# EAGLE schematic ARCAdaptor (EAGLE 6.4)
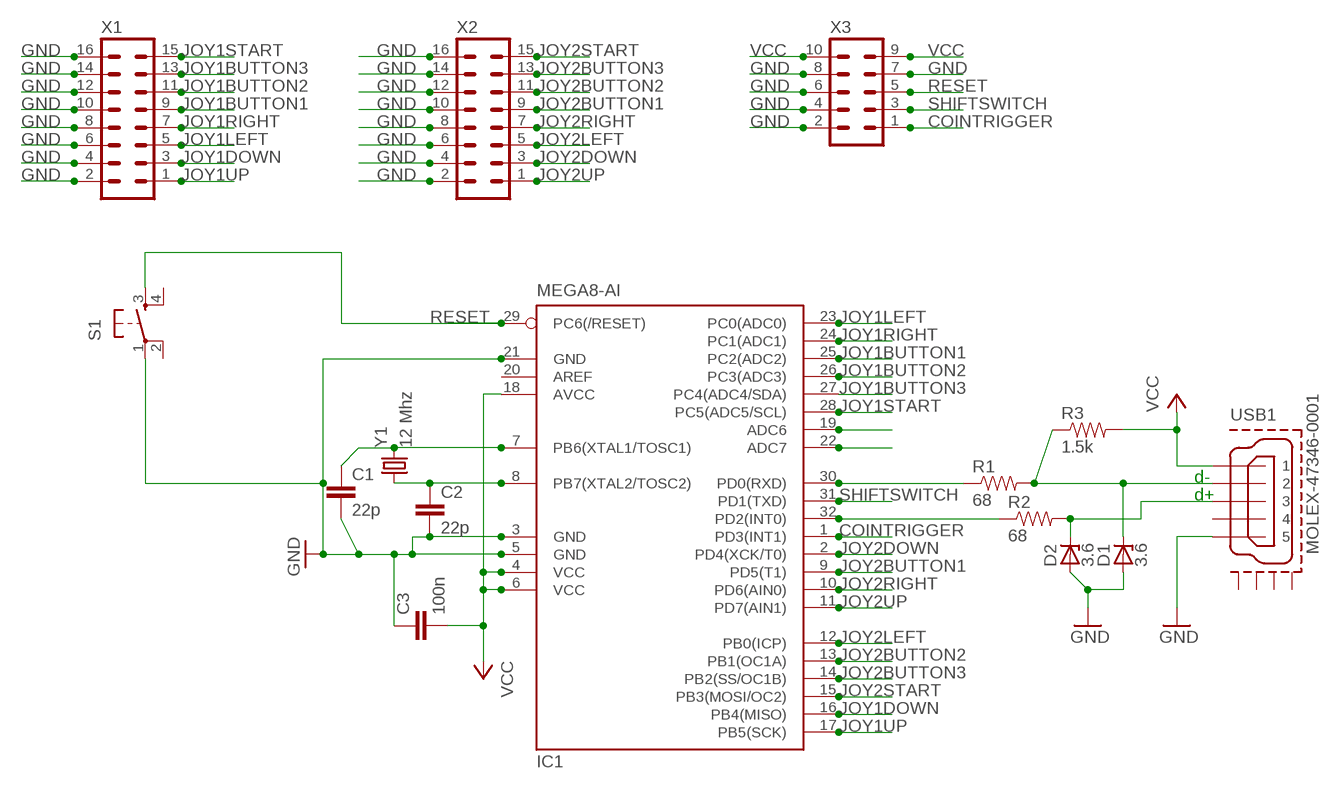
[diagram p0: schematic, sheet 1]

## Parts
C1  22p  CAP0805  [0805]
C2  22p  CAP0805  [0805]
C3  100n  CAP0805  [0805]
D1  3.6  ZENER-DIODESOT23  [SOT23]
D2  3.6  ZENER-DIODESOT23  [SOT23]
IC1  MEGA8-AI  [TQFP32-08]
R1  68  RESISTOR0805-RES  [0805]
R2  68  RESISTOR0805-RES  [0805]
R3  1.5k  RESISTOR0805-RES  [0805]
S1  TAC_SWITCHSMD  [TACTILE_SWITCH_SMD]
USB1  MOLEX-47346-0001  [MOLEX-47364-0001]
X1  MA08-2  [MA08-2]
X2  MA08-2  [MA08-2]
X3  MA05-2  [MA05-2]
Y1  12 Mhz  CRYSTAL5X3  [CRYSTAL-SMD-5X3]

## Nets
COINTRIGGER: IC1.1(PD3(INT1)) X3.1
GND: C1.2 C2.2 C3.1 D1.1(A) D2.1(A) IC1.3(GND) IC1.5(GND) IC1.21(GND) S1.1 USB1.5 X1.2 X1.4 X1.6 X1.8 X1.10 X1.12 X1.14 X1.16 X2.2 X2.4 X2.6 X2.8 X2.10 X2.12 X2.14 X2.16 X3.2 X3.4 X3.6 X3.7 X3.8
JOY1BUTTON1: IC1.25(PC2(ADC2)) X1.9
JOY1BUTTON2: IC1.26(PC3(ADC3)) X1.11
JOY1BUTTON3: IC1.27(PC4(ADC4/SDA)) X1.13
JOY1DOWN: IC1.16(PB4(MISO)) X1.3
JOY1LEFT: IC1.23(PC0(ADC0)) X1.5
JOY1RIGHT: IC1.24(PC1(ADC1)) X1.7
JOY1START: IC1.28(PC5(ADC5/SCL)) X1.15
JOY1UP: IC1.17(PB5(SCK)) X1.1
JOY2BUTTON1: IC1.9(PD5(T1)) X2.9
JOY2BUTTON2: IC1.13(PB1(OC1A)) X2.11
JOY2BUTTON3: IC1.14(PB2(SS/OC1B)) X2.13
JOY2DOWN: IC1.2(PD4(XCK/T0)) X2.3
JOY2LEFT: IC1.12(PB0(ICP)) X2.5
JOY2RIGHT: IC1.10(PD6(AIN0)) X2.7
JOY2START: IC1.15(PB3(MOSI/OC2)) X2.15
JOY2UP: IC1.11(PD7(AIN1)) X2.1
N$1: IC1.30(PD0(RXD)) R1.1
N$2: IC1.32(PD2(INT0)) R2.1
N$4: D2.3(C) R2.2 USB1.3
N$5: D1.3(C) R1.2 R3.1 USB1.2
N$8: C1.1 IC1.7(PB6(XTAL1/TOSC1)) Y1.3
N$9: C2.1 IC1.8(PB7(XTAL2/TOSC2)) Y1.1
N$14: IC1.19(ADC6)
N$15: IC1.22(ADC7)
RESET: IC1.29(PC6(/RESET)) S1.3 X3.5
SHIFTSWITCH: IC1.31(PD1(TXD)) X3.3
VCC: C3.2 IC1.4(VCC) IC1.6(VCC) IC1.18(AVCC) R3.2 USB1.1 X3.9 X3.10
Unconnected: IC1.20(AREF) S1.2 S1.4 USB1.4 USB1.GND1 USB1.GND2 USB1.GND3 USB1.GND4

## Notes on the sheet
- d-
- d+

## Library data of the parts
C1-C3 = SparkFun-Capacitors:CAP: Capacitor Standard 0603 ceramic capacitor, and 0.1" leaded capacitor.
D1 D2 = diode:ZENER-DIODE: Z-Diode
IC1 = atmel:MEGA8: MICROCONTROLLER 8 Kbytes FLASH, 1 kbytes SRAM, 512 bytes EEPROM, USART, 6-channel 10 bit ADC, 2-channel 8 bit ADC Pin compatible with Atmega48, ATMega88, ATMega168 Source: avr.lbr; MPN: ATMEGA8-16AU; OC_FARNELL: 9171371; OC_NEWARK: 73M8863
R1-R3 = SparkFun-Resistors:RESISTOR: Resistor Basic schematic elements and footprints for 0603, 1206, and PTH resistors.
S1 = SparkFun-Electromechanical:TAC_SWITCH: Momentary Switch Button commonly used for reset or general input. Spark Fun Electronics SKU : COM-00097 SMT- SWCH-08247; PROD_ID: SWCH-08247
USB1 = usb_con-update:MOLEX-47346-0001: MICRO USB B, BOTTOM MOUNT
X1 X2 = con-lstb:MA08-2: PIN HEADER; OC_FARNELL: unknown; OC_NEWARK: unknown
X3 = con-lstb:MA05-2: PIN HEADER; OC_FARNELL: unknown; OC_NEWARK: unknown
Y1 = SparkFun-FreqCtrl:CRYSTAL: Various standard crystals. Proven footprints. Spark Fun Electronics SKU : COM-00534